# EAGLE design dcdc 1.3 0304 (EAGLE 9.6.2)
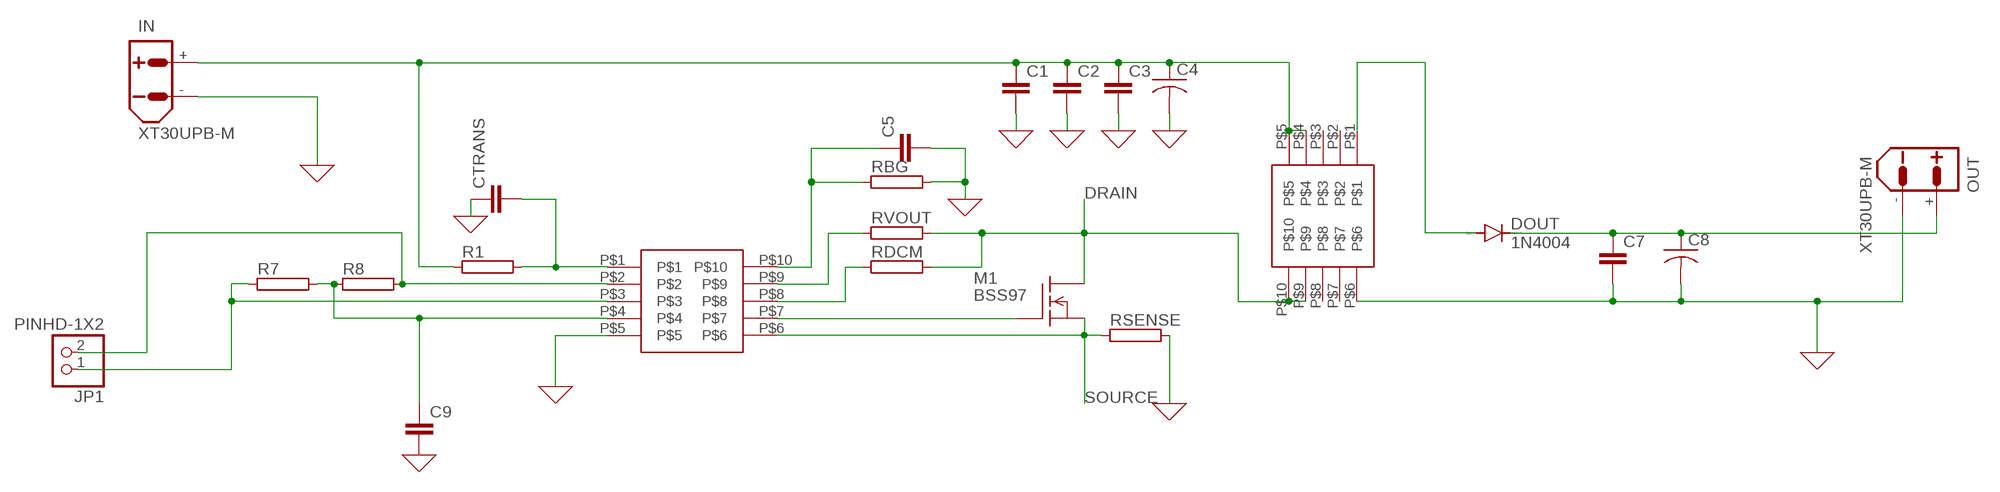
[diagram p0: schematic, sheet 1]

## Parts
C1  C5/3.5  [C5B3.5]
C2  C5/3.5  [C5B3.5]
C3  C5/3.5  [C5B3.5]
C4  C-US050-050X075  [C050-050X075]
C5  C5/3.5  [C5B3.5]
C7  C5/3.5  [C5B3.5]
C8  C-US050-050X075  [C050-050X075]
C9  C5/3.5  [C5B3.5]
CTRANS  C5/3.5  [C5B3.5]
DOUT  1N4004  [DO41-10]
IN  XT30UPB-M  [XT30UPB-M]
JP1  PINHD-1X2  [1X02]
M1  BSS97  [TO202]
OUT  XT30UPB-M  [XT30UPB-M]
R1  RAC01  [AC01]
R7  RAC01  [AC01]
R8  RAC01  [AC01]
RBG  RAC01  [AC01]
RDCM  RAC01  [AC01]
RSENSE  RAC01  [AC01]
RVOUT  RAC01  [AC01]
U$1  LT3750  [LT3750]
U$2  32052  [32052]

## Nets
0: C1.2 C2.2 C3.2 C4.2 C5.2 C7.2 C8.2 C9.2 CTRANS.1 IN.- OUT.- RBG.2 RSENSE.2 U$1.P$5 U$2.P$6 ; supply symbol labelled GND
DRAIN: M1.2(D) RDCM.2 RVOUT.2 U$2.P$9 U$2.P$10
N$1: C9.1 R7.2 R8.1 U$1.P$4
N$2: C5.1 RBG.1 U$1.P$10
N$3: RVOUT.1 U$1.P$9
N$4: RDCM.1 U$1.P$8
N$5: JP1.1 R7.1 U$1.P$3
N$6: M1.3(G) U$1.P$7
N$7: DOUT.A U$2.P$1
N$8: JP1.2 R8.2 U$1.P$2
N$10: C7.1 C8.1 DOUT.C OUT.+
N$13: C1.1 C2.1 C3.1 C4.1 IN.+ R1.1 U$2.P$4 U$2.P$5
N$14: CTRANS.2 R1.2 U$1.P$1
SOURCE: M1.1(S) RSENSE.1 U$1.P$6
Unconnected: U$2.P$2 U$2.P$3 U$2.P$7 U$2.P$8

## Library data of the parts
C1-C3 C5 C7 C9 CTRANS = capacitor-wima:C: CAPACITOR naming: grid - package width
C4 C8 = rcl:C-US: CAPACITOR, American symbol; SPICEPREFIX: C
DOUT = diode:1N4004: DIODE general purpose rectifier, 1 A
IN OUT = amass:XT30: AMASS XT30 connector Store in Japan AMASS XT30 connector <https://szc.jp/ams-xt30>
JP1 = Connector:PINHD-1X2: PIN HEADER; CATEGORY: CONNECTOR; SUB-CATEGORY: PIN-HEADER
M1 = transistor-fet:BSS97: N-Channel Enhancement MOSFET 200V; 1.5A; 1,6Ohm
R1 R7 R8 RBG RDCM RSENSE RVOUT = resistor-power:R: Power Resitor; OC_FARNELL: unknown; OC_NEWARK: unknown
U$1 = boostTest1215:LT3750
U$2 = boostTest1215:32052

## Net classes
0 default: width 1 mm, drill 0.25 mm

## Board
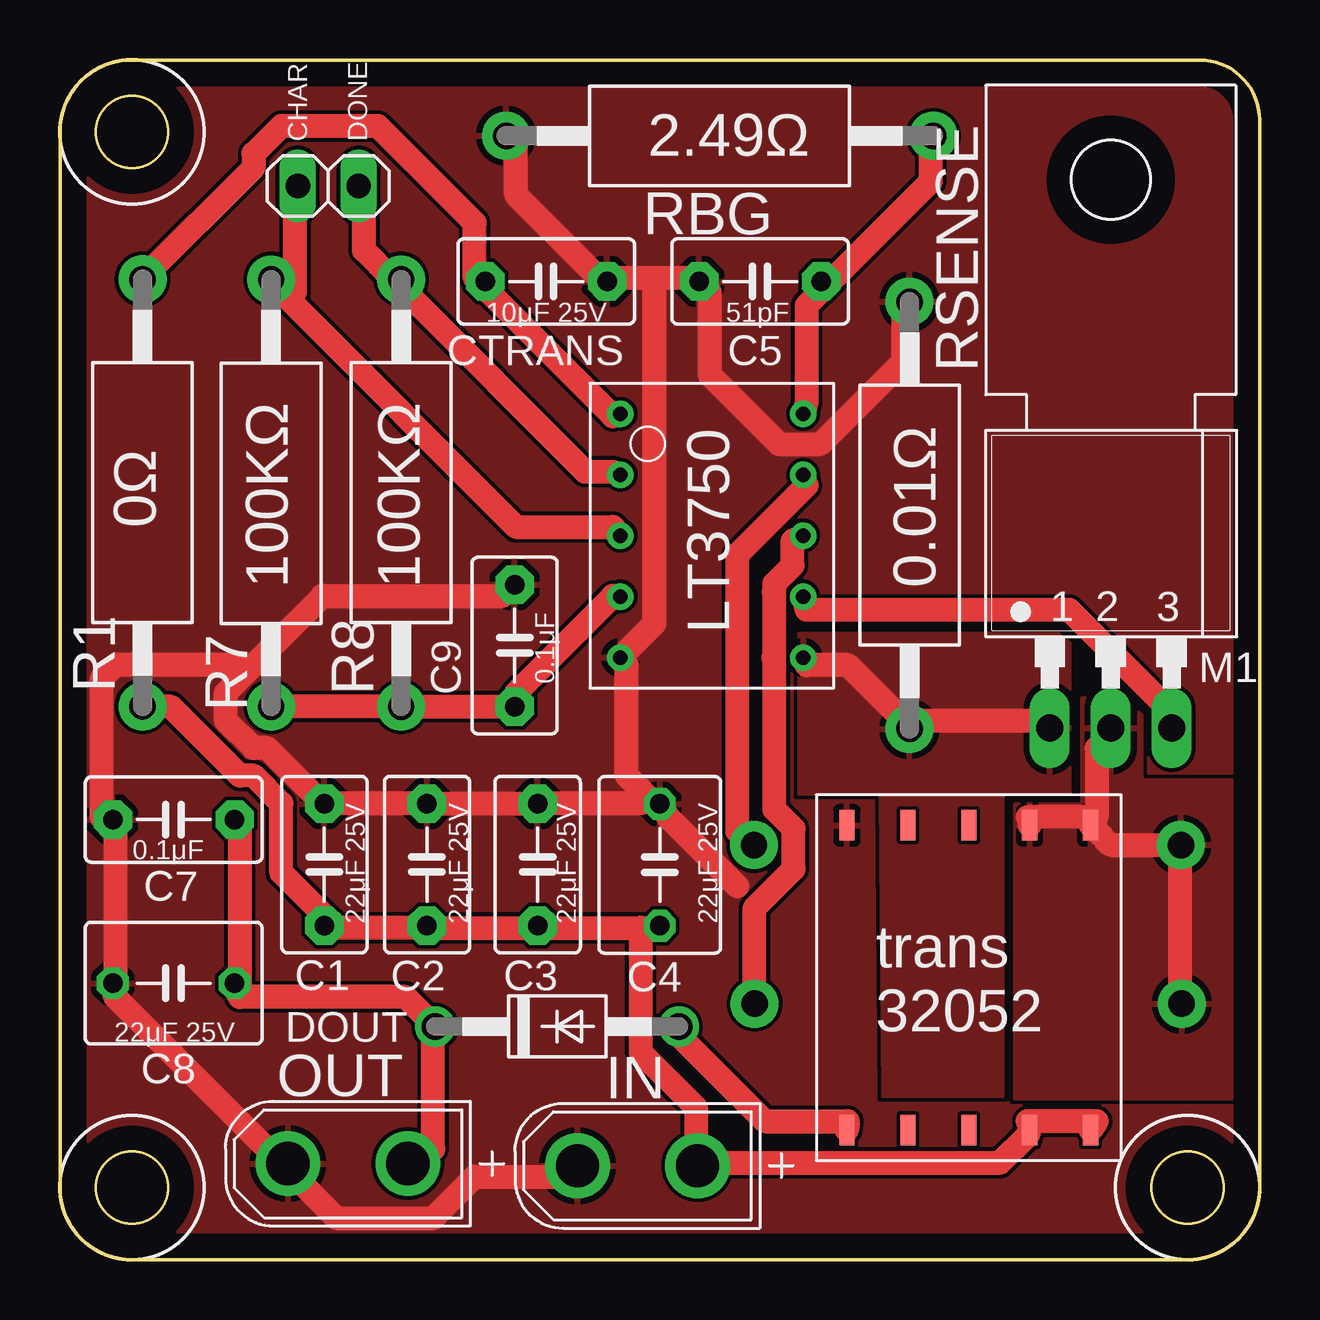
[diagram p1: board, top side]
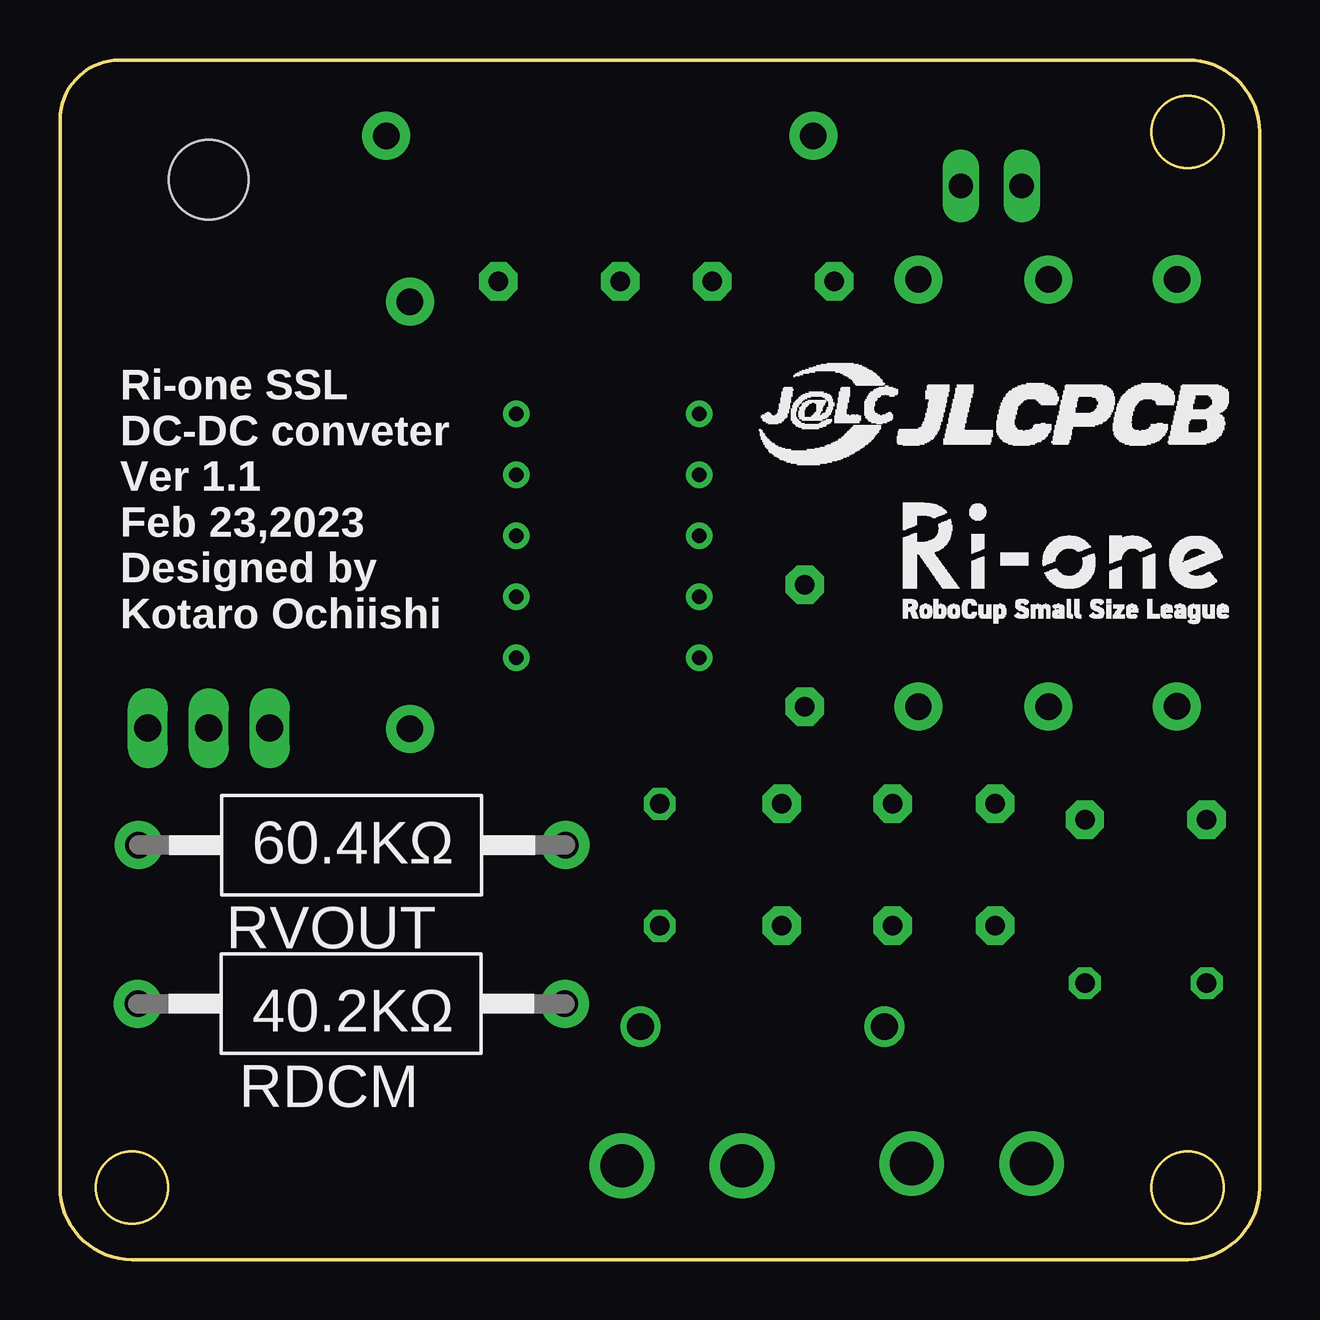
[diagram p2: board, bottom side, seen from below]

Size 50 x 50 mm. Coordinates in mm from the lower left corner, seen from the top.
Outline: 50,47.5 50,3 arc-90 47,0 3,0 arc-90 0,3 0,47 arc-90 3,50 47.5,50 arc-90 50,47.5
Outline: circle at 3,3 radius 1.5
Outline: circle at 47,3 radius 1.5
Outline: circle at 3,47 radius 1.5
Copper layers (1+2*15+16): Top 0.035mm / dielectric 1.5mm / Route2 0.035mm / dielectric 0.15mm / Route15 0.035mm / dielectric 0.2mm / Bottom 0.035mm
Design rules "default *": minimum track width 6mil, minimum drill 0.35mm, track to track 6mil, track to pad 6mil, pad to pad 6mil, via to via 6mil, smd to smd 6mil, copper to edge 40mil, drill to drill 6mil, minimum pad ring 10mil, minimum via ring 8mil, stop-mask expansion 4mil, vias tented up to drill 0mil, thermal gap 10mil
Holes 3 mm at 3,47 3,3 47,3

### Footprints (pad centres in the part's own frame; a part is rotated, then mirrored left to right if it is on the bottom)
C5B3.5 = drill 0.813 pad 1.6 octagon: 1 -2.54,0; 2 2.54,0
C050-050X075 = drill 0.813 octagon: 1 -2.54,0; 2 2.54,0
DO41-10 = drill 1.118: A 5.08,0; C -5.08,0
XT30UPB-M = drill 1.8: + 2.5,0; - -2.5,0
1X02 = drill 1.016 long: 1 -1.27,0; 2 1.27,0
TO202 = drill 1.118 long: 1 -2.54,-5.08; 2 0,-5.08; 3 2.54,-5.08 | hole 3.302: 0,17.78
AC01 = drill 1.1 pad 2: 1 -8.9,0; 2 8.9,0
LT3750 = drill 0.6: P$1 0,12.7; P$2 0,10.16; P$3 0,7.62; P$4 0,5.08; P$5 0,2.54; P$6 7.62,2.54; P$7 7.62,5.08; P$8 7.62,7.62; P$9 7.62,10.16; P$10 7.62,12.7
32052 = smd 1.27 x 0.635: P$1 1.27,11.43; P$2 1.27,8.89; P$3 1.27,6.35; P$4 1.27,3.81; P$5 1.27,1.27; P$6 13.97,11.43; P$7 13.97,8.89; P$8 13.97,6.35; P$9 13.97,3.81; P$10 13.97,1.27

### Placement (x,y rotation side)
C1  11.02,16.46 90 top
C2  15.3,16.46 90 top
C3  19.91,16.46 90 top
C4  25,16.45 90 top
C5  29.18,40.77 180 top
C7  4.74,18.34 180 top
C8  4.74,11.52 180 top
C9  18.95,25.59 90 top
CTRANS  20.27,40.77 180 top
DOUT  20.72,9.71 0 top
IN  24.07,3.91 0 top
JP1  11.18,44.75 0 top
M1  43.8,27.23 0 top
OUT  12,4 0 top
R1  3.44,31.96 90 top
R7  8.8,31.95 270 top
R8  14.22,31.95 90 top
RBG  27.5,46.84 180 top
RDCM  37.86,10.67 180 bottom
RSENSE  35.41,31.02 90 top
RVOUT  37.83,17.28 180 bottom
U$1  23.36,22.55 0 top
U$2  44.23,4.13 90 top

### Tracks (layer width: path | path; a pad name or v marks a point on that pad's centre or on a via)
0
  Top 1: IN.- 21.32,3.46 17.29,3.46 15.56,1.73 11.52,1.73 9.79,3.46 OUT.- 9.22,4.03 2.31,10.95 C8.2 2.31,11.52 2.31,17.86 C7.2 1.73,18.44 1.73,24.2 2.31,24.78 7.49,24.78 7.78,24.49 | 24.78,40.91 26.5,40.91 C5.2 27.08,40.33 27.08,36.88 29.96,34 31.69,34 35.15,37.45 35.15,39.76 RSENSE.2 | 24.78,40.91 23.05,40.91 CTRANS.1 22.47,40.91 19.02,44.37 19.02,46.67 RBG.2 | 28.23,15.56 25.35,18.44 C4.2 24.78,19.02 24.49,19.3 | 24.49,19.3 23.62,20.17 23.62,24.78 U$1.P$5 23.62,25.35 24.78,26.5 24.78,40.91 | 24.49,19.3 24.2,19.02 20.17,19.02 C3.2 19.59,19.02 15.56,19.02 C2.2 14.98,19.02 11.52,19.02 C1.2 10.95,19.02 8.64,21.32 8.07,21.32 6.91,22.47 6.91,23.62 7.78,24.49 | 7.78,24.49 10.95,27.66 18.44,27.66 C9.2
  pour Top (rank 3): -2,52 -2,-1.5 51,-1.5 51,52.5 -1.5,52.5 -2,52.5
DRAIN
  Top 1: 43.22,18.44 40.33,18.44 U$2.P$9 | 43.22,18.44 43.22,21.32 43.79,21.9 M1.2 | 43.22,18.44 U$2.P$10 43.22,17.86 43.79,17.29 46.67,17.29 RVOUT.2 46.67,16.71 46.67,10.95 RDCM.2
  pour Top: 42.6,23.4 42.6,19.1 42.6,19 39.8,19 39.8,6.7 49.4,6.7 49.4,20 45.1,20 45.1,22.7 44.3,23.4
N$1
  Top 1: U$1.P$4 23.05,27.66 19.02,23.62 C9.1 18.44,23.05 14.4,23.05 R8.1 13.83,23.05 9.22,23.05 R7.2
N$2
  Top 1: U$1.P$10 31.11,35.72 31.11,39.76 31.69,40.33 C5.1 32.27,40.91 36.3,44.94 36.3,46.67 RBG.1
N$3
  Top 1: U$1.P$9 31.11,32.27 28.23,29.39 28.23,17.86 28.81,17.29 RVOUT.1
N$4
  Top 1: U$1.P$8 30.54,29.96 30.54,28.93 29.77,28.17 29.77,27.86 29.75,27.82 29.77,27.71 29.77,25.18 29.73,25.07 29.77,24.98 29.77,18.77 30.58,17.96 30.58,16.27 28.96,14.65 RDCM.1
N$5
  Top 1: 9.51,40.05 9.22,40.33 R7.1 | 9.51,40.05 19.02,30.54 23.05,30.54 U$1.P$3 | JP1.1 9.79,44.37 9.79,40.33 9.51,40.05
N$6
  Top 1: U$1.P$7 31.11,27.08 42.06,27.08 46.67,22.47 M1.3
N$7
  Top 1: U$2.P$1 32.84,5.76 29.39,5.76 25.93,9.22 DOUT.A
N$8
  Top 1: U$1.P$2 23.05,32.84 21.9,32.84 14.4,40.33 R8.2 13.83,40.91 12.68,42.06 12.68,44.37 JP1.2
N$10
  Top 1: C7.1 7.49,17.86 7.49,11.52 C8.1 7.49,10.95 14.4,10.95 15.56,9.79 DOUT.C 15.56,9.22 15.56,4.61 14.98,4.03 OUT.+
N$13
  Top 1: U$2.P$5 43.22,5.76 40.33,5.76 U$2.P$4 40.33,5.19 39.18,4.03 27.08,4.03 IN.+ 26.5,4.03 26.5,6.34 24.2,8.64 24.2,13.83 | 24.2,13.83 20.17,13.83 C3.1 19.59,13.83 15.56,13.83 C2.1 14.98,13.83 11.52,13.83 C1.1 10.95,14.4 9.22,16.13 9.22,19.02 8.07,20.17 7.49,20.17 4.61,23.05 3.46,23.05 R1.1 | 24.2,13.83 24.78,13.83 C4.1
N$14
  Top 1: U$1.P$1 23.05,35.15 17.86,40.33 CTRANS.2 17.29,40.91 17.29,43.22 13.25,47.25 9.22,47.25 8.07,46.1 8.07,45.52 3.46,40.91 R1.2
SOURCE
  Top 1: U$1.P$6 31.11,24.78 32.84,24.78 35.15,22.47 RSENSE.1 35.72,22.47 40.91,22.47 M1.1
  pour Top: 30.8,25.9 30.8,19.4 34.2,19.4 34.3,6.8 39.3,6.8 39.3,19.4 42.1,19.4 42.1,25.7 41.6,26.1 30.8,26.1

### Text on the board
tPlace: CHAR | DONE | 2.49Ω | 10μF 25V | 51pF | 0Ω | 100KΩ | 100KΩ | 0.01Ω | LT3750 | 0.1μF | 0.1μF | 22μF 25V | 22μF 25V | 22μF 25V | 22μF 25V | 22μF 25V | trans / 32052
bPlace: Ri-one SSL / DC-DC conveter / Ver 1.1 / Feb 23,2023 / Designed by / Kotaro Ochiishi | 60.4KΩ | 40.2KΩ